# EAGLE schematic 612_jetracer_32u4 (EAGLE 9.6.2)
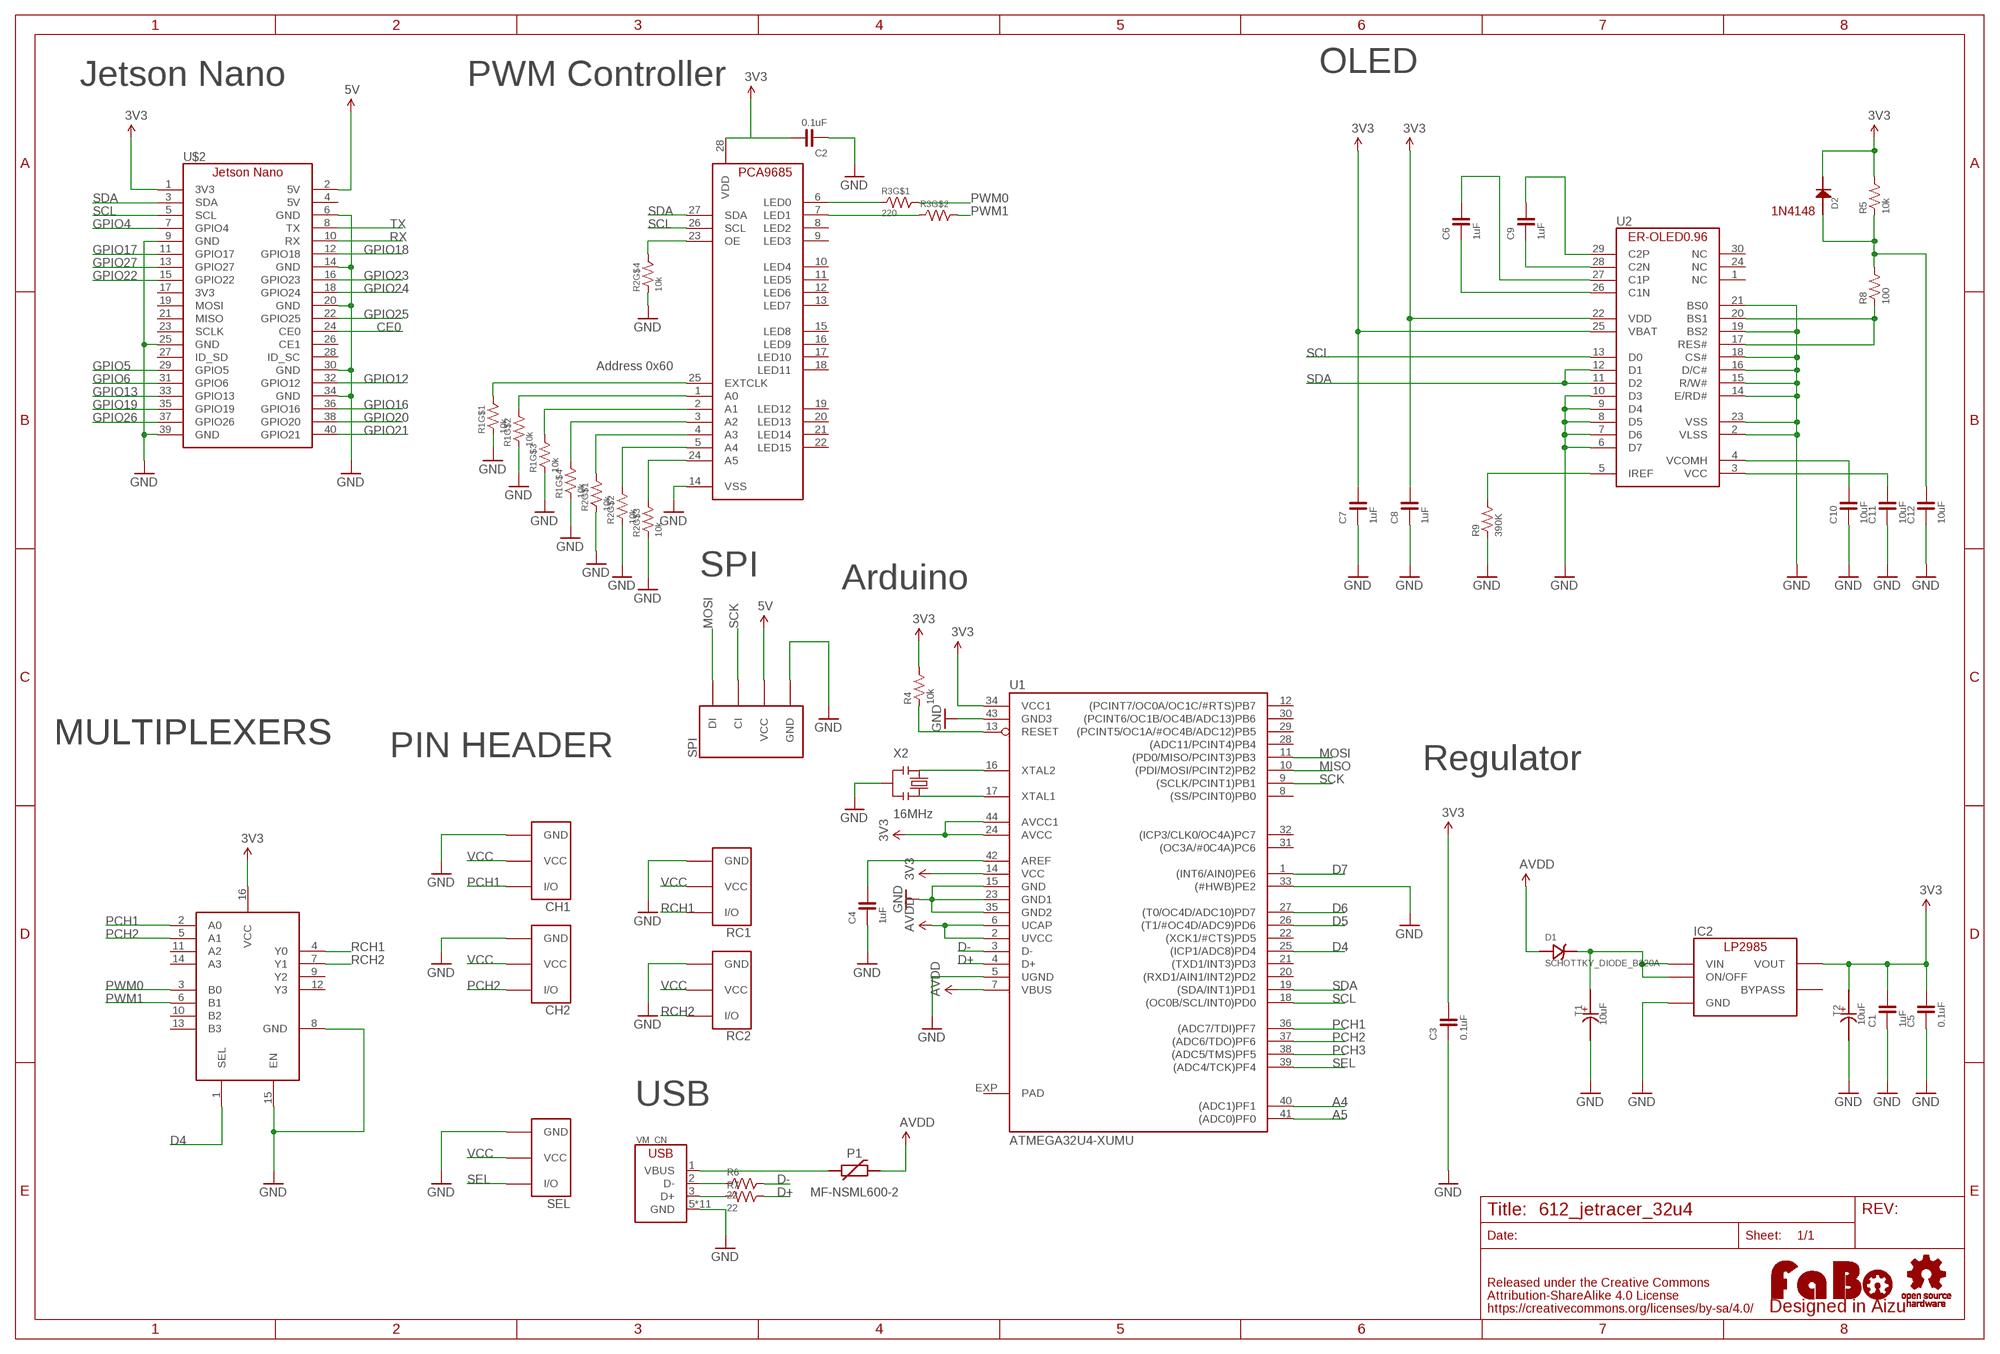
[diagram p0: schematic, sheet 1]

## Parts
C1  1uF  CAPACITOR-0603  [0603]
C2  0.1uF  CAPACITOR-0603  [0603]
C3  0.1uF  CAPACITOR-0603  [0603]
C4  1uF  CAPACITOR-0603  [0603]
C5  0.1uF  CAPACITOR-0603  [0603]
C6  1uF  CAPACITOR-0603-BOTTOM  [0603-BOTTOM]
C7  1uF  CAPACITOR-0603-BOTTOM  [0603-BOTTOM]
C8  1uF  CAPACITOR-0603-BOTTOM  [0603-BOTTOM]
C9  1uF  CAPACITOR-0603-BOTTOM  [0603-BOTTOM]
C10  10uF  CAPACITOR-0603-BOTTOM  [0603-BOTTOM]
C11  10uF  CAPACITOR-0603-BOTTOM  [0603-BOTTOM]
C12  10uF  CAPACITOR-0603-BOTTOM  [0603-BOTTOM]
CH1  FABO_BRICK_3PIN-HEADER  [FABO_BRICK_3PIN_HEADER]
CH2  FABO_BRICK_3PIN-HEADER  [FABO_BRICK_3PIN_HEADER]
D1  SCHOTTKY_DIODE_B320A  [B320A]
D2  1N4148  [1N4148W]
IC2  LP2985-33DBV  [SOT-23-5]
IC3  MULTIPLEXERSMC74HC157A  [TSSOP-16]
P1  MF-NSML600-2  POLYSWITCH1206  [1206]
R1  10k  RESISTOR_ARRAY  [EXBV8V]
R2  10k  RESISTOR_ARRAY  [EXBV8V]
R3  220  RESISTOR_ARRAY  [EXBV8V]
R4  10k  RESISTOR-0603  [0603]
R5  10k  RESISTOR-0603-BOTTOM  [0603-BOTTOM]
R6  22  RESISTOR-0603  [0603]
R7  22  RESISTOR-0603  [0603]
R8  100  RESISTOR-0603-BOTTOM  [0603-BOTTOM]
R9  390K  RESISTOR-0603-BOTTOM  [0603-BOTTOM]
RC1  FABO_BRICK_3PIN-HEADER  [FABO_BRICK_3PIN_HEADER]
RC2  FABO_BRICK_3PIN-HEADER  [FABO_BRICK_3PIN_HEADER]
SEL  FABO_BRICK_3PIN-HEADER  [FABO_BRICK_3PIN_HEADER]
SPI  FABO-SPI-LED-B04B  [SPI-B04B-PASK-1]
T1  10uF  CAPACITOR-TANTULM  [1206-TANTULM]
T2  10uF  CAPACITOR-TANTULM  [1206-TANTULM]
U1  ATMEGA32U4-XUMU  [QFN44ML7X7]
U2  ER-OLED0.96-1ER-CON30HT-1  [ER-CON30HT-1]
U$2  JETSON_NANO_NOBORDER  [JETSON_NANO_NOBOARDER]
U$3  LOGO_OSHW-M_BOTTOM  [LOGO_OSHW_M_BOTTOM]
U$4  PCA9685_BOTTOM  [PCA9685_BOTTOM]
U$5  LOGO_FABO-M  [LOGO_FABO_MS]
VM_CN  USB-ZX62D  [ZX62D-B-5PA8]
X2  16MHz  RESONATOR  [CSTNE_V_C]

## Nets
3V3: C1.2 C2.2 C3.2 C5.2 C7.2 D2.CATHODE IC2.5(VOUT) IC3.16(VCC) R4.2 R5.2 T2.+ U1.14(VCC) U1.24(AVCC) U1.34(VCC1) U1.44(AVCC1) U2.25(VBAT) U$2.1(3V3) U$4.28(VDD)
5V: SPI.VCC U$2.2(5V)
A4: U1.40((ADC1)PF1)
A5: U1.41((ADC0)PF0)
AVDD: D1.CATHODE P1.P$2 U1.2(UVCC) U1.6(UCAP) U1.7(VBUS)
CE0: U$2.24(CE0)
D4: IC3.1(SEL) U1.25((ICP1/ADC8)PD4)
D5: U1.26((T1/#OC4D/ADC9)PD6)
D6: U1.27((T0/OC4D/ADC10)PD7)
D7: U1.1((INT6/AIN0)PE6)
D+: R7.2 U1.4(D+)
D-: R6.2 U1.3(D-)
GND: C1.1 C2.1 C3.1 C4.1 C5.1 C7.1 C8.1 C10.1 C11.1 C12.1 CH1.GND CH2.GND IC2.2(GND) IC3.8(GND) IC3.15(EN) R1.1 R1.2 R1.3 R1.4 R2.1 R2.2 R2.3 R2.4 R9.1 RC1.GND RC2.GND SEL.GND SPI.GND T1.- T2.- U1.5(UGND) U1.15(GND) U1.23(GND1) U1.33((#HWB)PE2) U1.35(GND2) U1.43(GND3) U2.2(VLSS) U2.6(D7) U2.7(D6) U2.8(D5) U2.9(D4) U2.10(D3) U2.14(E/RD#) U2.15(R/W#) U2.16(D/C#) U2.18(CS#) U2.19(BS2) U2.21(BS0) U2.23(VSS) U$2.6(GND) U$2.9(GND) U$2.14(GND) U$2.20(GND) U$2.25(GND) U$2.30(GND) U$2.34(GND) U$2.39(GND) U$4.14(VSS) VM_CN.5(GND) VM_CN.B1(GND) VM_CN.B2(GND) VM_CN.B3(GND) VM_CN.B4(GND) VM_CN.T1(GND) VM_CN.T2(GND) VM_CN.T3(GND) VM_CN.T4(GND) VM_CN.T5(GND) VM_CN.T6(GND) X2.2
GPIO4: U$2.7(GPIO4)
GPIO5: U$2.29(GPIO5)
GPIO6: U$2.31(GPIO6)
GPIO12: U$2.32(GPIO12)
GPIO13: U$2.33(GPIO13)
GPIO16: U$2.36(GPIO16)
GPIO17: U$2.11(GPIO17)
GPIO18: U$2.12(GPIO18)
GPIO19: U$2.35(GPIO19)
GPIO20: U$2.38(GPIO20)
GPIO21: U$2.40(GPIO21)
GPIO22: U$2.15(GPIO22)
GPIO23: U$2.16(GPIO23)
GPIO24: U$2.18(GPIO24)
GPIO25: U$2.22(GPIO25)
GPIO26: U$2.37(GPIO26)
GPIO27: U$2.13(GPIO27)
MISO: U1.10((PDI/MOSI/PCINT2)PB2)
MOSI: SPI.DI U1.11((PD0/MISO/PCINT3)PB3)
N$2: R3.1 U$4.6(LED0)
N$3: R3.2 U$4.7(LED1)
N$4: C4.2 U1.42(AREF)
N$5: U1.16(XTAL2) X2.1
N$6: R6.1 VM_CN.2(D-)
N$7: R2.5 U$4.23(OE)
N$8: R1.8 U$4.25(EXTCLK)
N$9: R1.7 U$4.1(A0)
N$10: R1.6 U$4.2(A1)
N$11: R1.5 U$4.3(A2)
N$12: R2.8 U$4.4(A3)
N$13: R2.7 U$4.5(A4)
N$14: U1.17(XTAL1) X2.3
N$15: C6.2 U2.27(C1P)
N$16: R4.1 U1.13(RESET)
N$17: R7.1 VM_CN.3(D+)
N$18: D1.ANODE IC2.1(VIN) IC2.3(ON/OFF) T1.+
N$19: R2.6 U$4.24(A5)
N$20: C6.1 U2.26(C1N)
N$21: C9.1 U2.28(C2N)
N$22: C9.2 U2.29(C2P)
N$23: R9.2 U2.5(IREF)
N$24: C10.2 U2.4(VCOMH)
N$25: C11.2 U2.3(VCC)
N$26: R8.1 U2.17(RES#) U2.20(BS1)
N$27: C12.2 D2.ANODE R5.1 R8.2
N$30: C8.2 U2.22(VDD) ; supply symbol labelled 3V3
PCH1: CH1.I/O IC3.2(A0) U1.36((ADC7/TDI)PF7)
PCH2: CH2.I/O IC3.5(A1) U1.37((ADC6/TDO)PF6)
PCH3: U1.38((ADC5/TMS)PF5)
PTCP1: P1.P$1 VM_CN.1(VBUS)
PWM0: IC3.3(B0) R3.8
PWM1: IC3.6(B1) R3.7
RCH1: IC3.4(Y0) RC1.I/O
RCH2: IC3.7(Y1) RC2.I/O
RX: U$2.10(RX)
SCK: SPI.CI U1.9((SCLK/PCINT1)PB1)
SCL: U1.18((OC0B/SCL/INT0)PD0) U2.13(D0) U$2.5(SCL) U$4.26(SCL)
SDA: U1.19((SDA/INT1)PD1) U2.11(D2) U2.12(D1) U$2.3(SDA) U$4.27(SDA)
SEL: SEL.I/O U1.39((ADC4/TCK)PF4)
TX: U$2.8(TX)
VCC: CH1.VCC CH2.VCC RC1.VCC RC2.VCC SEL.VCC
Unconnected: IC2.4(BYPASS) IC3.9(Y2) IC3.10(B2) IC3.11(A2) IC3.12(Y3) IC3.13(B3) IC3.14(A3) R3.3 R3.4 R3.5 R3.6 U1.8((SS/PCINT0)PB0) U1.12((PCINT7/OC0A/OC1C/#RTS)PB7) U1.20((RXD1/AIN1/INT2)PD2) U1.21((TXD1/INT3)PD3) U1.22((XCK1/#CTS)PD5) U1.28((ADC11/PCINT4)PB4) U1.29((PCINT5/OC1A/#OC4B/ADC12)PB5) U1.30((PCINT6/OC1B/OC4B/ADC13)PB6) U1.31((OC3A/#0C4A)PC6) U1.32((ICP3/CLK0/OC4A)PC7) U2.1(NC) U2.24(NC) U2.30(NC) U$2.4(5V) U$2.17(3V3) U$2.19(MOSI) U$2.21(MISO) U$2.23(SCLK) U$2.26(CE1) U$2.27(ID_SD) U$2.28(ID_SC) U$4.8(LED2) U$4.9(LED3) U$4.10(LED4) U$4.11(LED5) U$4.12(LED6) U$4.13(LED7) U$4.15(LED8) U$4.16(LED9) U$4.17(LED10) U$4.18(LED11) U$4.19(LED12) U$4.20(LED13) U$4.21(LED14) U$4.22(LED15)

## Notes on the sheet
- OLED
- Jetson Nano | PWM Controller
- 1N4148
- Address 0x60
- SPI
- Arduino
- MULTIPLEXERS | MULTIPLEXERS
- PIN HEADER
- Regulator
- USB

## Power pins joined to a net without a drawn wire
PAD: U1.EXP(PAD)

## Library data of the parts
C1-C12 = FaBo-Capacitor:CAPACITOR: CAPACITOR
CH1 CH2 RC1 RC2 SEL = FaBo-Template:FABO_BRICK_3PIN: FaBo Brick 3pin
D1 = FaBo-Diode:SCHOTTKY_DIODE
D2 = FaBo-Diode:1N4148
IC2 = FaBo-Supply:LP2985: LP2985
IC3 = FaBo-Multiplexers:MULTIPLEXERS
P1 = FaBo-Supply:POLYSWITCH
R1-R3 = component:RESISTOR_ARRAY
R4-R9 = FaBo-Resistors:RESISTOR: RESISTOR
SPI = FaBo-Connetor:FABO-SPI-LED
T1 T2 = FaBo-Capacitor:CAPACITOR-TANTULM
U1 = SmartPrj:ATMEGA32U4-XU
U2 = FaBo-Display:ER-OLED0.96-1
U$2 = FaBo-Boards:JETSON_NANO
U$3 = FaBo-Logo:LOGO_OSHW
U$4 = FaBo-Motor:PCA9685
U$5 = FaBo-Logo:LOGO_FABO
VM_CN = component:USB
X2 = component:RESONATOR

## Net classes
2 gnd: width 0.254 mm, drill 0.61 mm, clearance 0.254 mm
3 usbvcc: width 0.254 mm, drill 0.61 mm, clearance 0.254 mm
4 aref: width 0.254 mm, drill 0.61 mm, clearance 0.254 mm